# EAGLE design th (EAGLE 9.3.0)
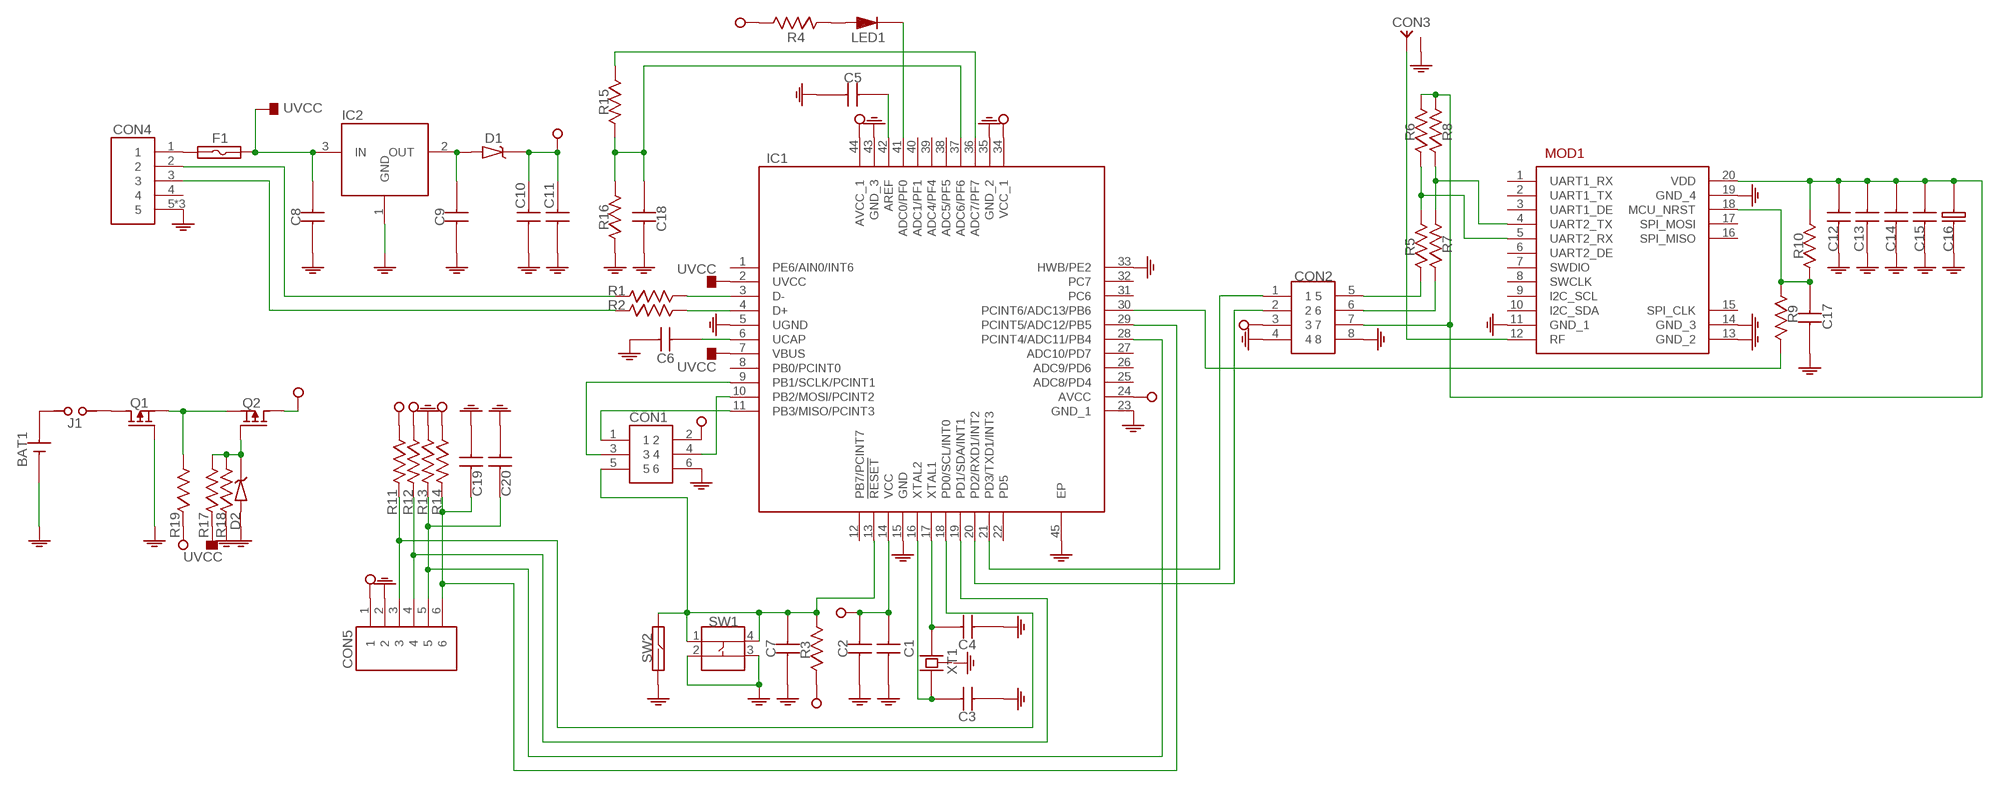
[diagram p0: schematic, sheet 1]

## Parts
BAT1  211P-C-HOLDER  [211P-C-HOLDER]
C1  CAPACITOR-0603  [0603]
C2  CAPACITOR-0603  [0603]
C3  CAPACITOR-0603  [0603]
C4  CAPACITOR-0603  [0603]
C5  CAPACITOR-0603  [0603]
C6  CAPACITOR-0603  [0603]
C7  CAPACITOR-0603  [0603]
C8  CAPACITOR-0805  [0805]
C9  CAPACITOR-0805  [0805]
C10  CAPACITOR-0603  [0603]
C11  CAPACITOR-0603  [0603]
C12  CAPACITOR-0603  [0603]
C13  CAPACITOR-0603  [0603]
C14  CAPACITOR-0603  [0603]
C15  CAPACITOR-0603  [0603]
C16  CAPACITOR-10-5  [CAPACITOR-10-5]
C17  CAPACITOR-0603  [0603]
C18  CAPACITOR-0603  [0603]
C19  CAPACITOR-0603  [0603]
C20  CAPACITOR-0603  [0603]
CON1  ISP  [ISP]
CON2  HEADER-8P-2R-DIP-2_54MM  [HEADER-8P-2R-DIP-2_54MM]
CON3  SMA-RF  [SMA-RF]
CON4  USB-MICRO-DIP-VER  [USB-MICRO-DIP-VER]
CON5  HEADER-6P-DIP-2_54MM  [HEADER-6P-DIP-2_54MM]
D1  DIODE-SCHOTTKY  [SOD123-DIODE]
D2  ZENER-SOD123  [SOD123-DIODE]
F1  FUSE-1206  [1206]
IC1  ATMEGA32U4-MU  [QFN-44]
IC2  VREG-SOT23-3  [SOT23-3]
J1  JUMPER  [HEADER-2P-DIP-2_54MM]
LED1  LED-0805  [0805-LED]
MOD1  RAK4200  [RAK4200]
Q1  P-MOSFET  [SOT23-3]
Q2  P-MOSFET  [SOT23-3]
R1  RESISTOR-0603  [0603]
R2  RESISTOR-0603  [0603]
R3  RESISTOR-0603  [0603]
R4  RESISTOR-0603  [0603]
R5  RESISTOR-0603  [0603]
R6  RESISTOR-0603  [0603]
R7  RESISTOR-0603  [0603]
R8  RESISTOR-0603  [0603]
R9  RESISTOR-0603  [0603]
R10  RESISTOR-0603  [0603]
R11  RESISTOR-0603  [0603]
R12  RESISTOR-0603  [0603]
R13  RESISTOR-0603  [0603]
R14  RESISTOR-0603  [0603]
R15  RESISTOR-0603  [0603]
R16  RESISTOR-0603  [0603]
R17  RESISTOR-0603  [0603]
R18  RESISTOR-0603  [0603]
R19  RESISTOR-0603  [0603]
SW1  BUTTON-4P-SMD-5X5  [BUTTON-4P-SMD-5X5]
SW2  REED-DIP  [REED-DIP]
XT1  CRYSTAL-5032-4P  [CRYSTAL-5032-4P]

## Nets
GND: BAT1.2(-) C1.1 C2.1 C3.1 C4.1 C5.1 C6.1 C7.1 C8.1 C9.1 C10.1 C11.1 C12.1 C13.1 C14.1 C15.1 C16.P$1 C17.1 C18.1 C19.1 C20.1 CON1.6 CON2.4 CON2.8 CON3.2(GND) CON3.3(GND) CON3.4(GND) CON3.5(GND) CON4.5 CON4.6 CON4.7 CON5.2 D2.2(A) IC1.5(UGND) IC1.15(GND) IC1.23(GND_1) IC1.33(HWB/PE2) IC1.35(GND_2) IC1.43(GND_3) IC1.45(EP) IC2.1(GND) MOD1.11(GND_1) MOD1.13(GND_2) MOD1.14(GND_3) MOD1.19(GND_4) Q1.1(G) R13.1 R16.1 R18.1 SW1.2 SW1.3 SW2.P$2
N$1: C7.2 CON1.5 IC1.13(!RESET) R3.2 SW1.1 SW1.4 SW2.P$1
N$2: C17.2 MOD1.18(MCU_NRST) R9.1 R10.1
N$3: CON1.1 IC1.11(PB3/MISO/PCINT3)
N$4: CON3.1(ANT) MOD1.12(RF)
N$5: J1.1 Q1.3(D)
N$6: CON2.5 R5.1
N$7: CON2.6 R7.1
N$8: BAT1.1(+) J1.2
N$9: CON1.4 IC1.10(PB2/MOSI/PCINT2)
N$10: C3.2 IC1.16(XTAL2) XT1.1
N$11: CON2.2 IC1.20(PD2/RXD1/INT2)
N$12: C4.2 IC1.17(XTAL1) XT1.3
N$13: IC1.41(ADC0/PF0) LED1.1(K)
N$14: C20.2 CON5.5 IC1.28(PCINT4/ADC11/PB4) R13.2
N$15: C9.2 D1.2(A) IC2.2(OUT)
N$16: IC1.30(PCINT6/ADC13/PB6) R9.2
N$17: CON4.2 R1.1
N$18: IC1.3(D-) R1.2
N$19: IC1.4(D+) R2.2
N$20: C18.2 IC1.37(ADC6/PF6) R15.2 R16.2
N$21: D2.1(K) Q2.1(G) R17.2 R18.2
N$22: C12.2 C13.2 C14.2 C15.2 C16.P$2 CON2.7 MOD1.20(VDD) R6.2 R8.2 R10.2
N$23: CON2.1 IC1.21(PD3/TXD1/INT3)
N$24: CON4.3 R2.1
N$25: C19.2 CON5.6 IC1.29(PCINT5/ADC12/PB5) R14.2
N$26: Q1.2(S) Q2.2(S) R19.2
N$30: MOD1.4(UART2_TX) R7.2 R8.1
N$31: C5.2 IC1.42(AREF)
N$32: MOD1.5(UART2_RX) R5.2 R6.1
N$33: CON4.1 F1.1
N$34: C6.2 IC1.6(UCAP)
N$35: LED1.2(A) R4.1
N$36: IC1.36(ADC7/PF7) R15.1
N$45: CON1.3 IC1.9(PB1/SCLK/PCINT1)
N$73: CON5.3 IC1.18(PD0/SCL/INT0) R11.2
N$79: CON5.4 IC1.19(PD1/SDA/INT1) R12.2
UVCC: C8.2 F1.2 IC1.2(UVCC) IC1.7(VBUS) IC2.3(IN) R17.1
VCC: C1.2 C2.2 C10.2 C11.2 CON1.2 CON2.3 CON5.1 D1.1(K) IC1.14(VCC) IC1.24(AVCC) IC1.34(VCC_1) IC1.44(AVCC_1) Q2.3(D) R3.1 R4.2 R11.1 R12.1 R14.1 R19.1
Unconnected: CON4.4 IC1.1(PE6/AIN0/INT6) IC1.8(PB0/PCINT0) IC1.12(PB7/PCINT7) IC1.22(PD5) IC1.25(ADC8/PD4) IC1.26(ADC9/PD6) IC1.27(ADC10/PD7) IC1.31(PC6) IC1.32(PC7) IC1.38(ADC5/PF5) IC1.39(ADC4/PF4) IC1.40(ADC1/PF1) MOD1.1(UART1_RX) MOD1.2(UART1_TX) MOD1.3(UART1_DE) MOD1.6(UART2_DE) MOD1.7(SWDIO) MOD1.8(SWCLK) MOD1.9(I2C_SCL) MOD1.10(I2C_SDA) MOD1.15(SPI_CLK) MOD1.16(SPI_MISO) MOD1.17(SPI_MOSI)

## Power pins joined to a net without a drawn wire
GND: XT1.2(GND) XT1.4(GND)

## Library data of the parts
BAT1 = myparts:211P-C-HOLDER
C1-C7 C10-C15 C17-C20 = myparts:CAPACITOR-0603
C8 C9 = myparts:CAPACITOR-0805
C16 = myparts:CAPACITOR-10-5
CON1 = myparts:ISP
CON2 = myparts:HEADER-8P-2R-DIP-2_54MM
CON3 = myparts:SMA-RF
CON4 = myparts:USB-MICRO-DIP-VER
CON5 = myparts:HEADER-6P-DIP-2_54MM
D1 = myparts:DIODE-SCHOTTKY
D2 = myparts:ZENER-SOD123
F1 = myparts:FUSE-1206
IC1 = myparts:ATMEGA32U4-MU
IC2 = myparts:VREG-SOT23-3
J1 = myparts:JUMPER
LED1 = myparts:LED-0805
MOD1 = myparts:RAK4200
Q1 Q2 = myparts:P-MOSFET
R1-R19 = myparts:RESISTOR-0603
SW1 = myparts:BUTTON-4P-SMD-5X5
SW2 = myparts:REED-DIP
XT1 = myparts:CRYSTAL-5032-4P

## Board
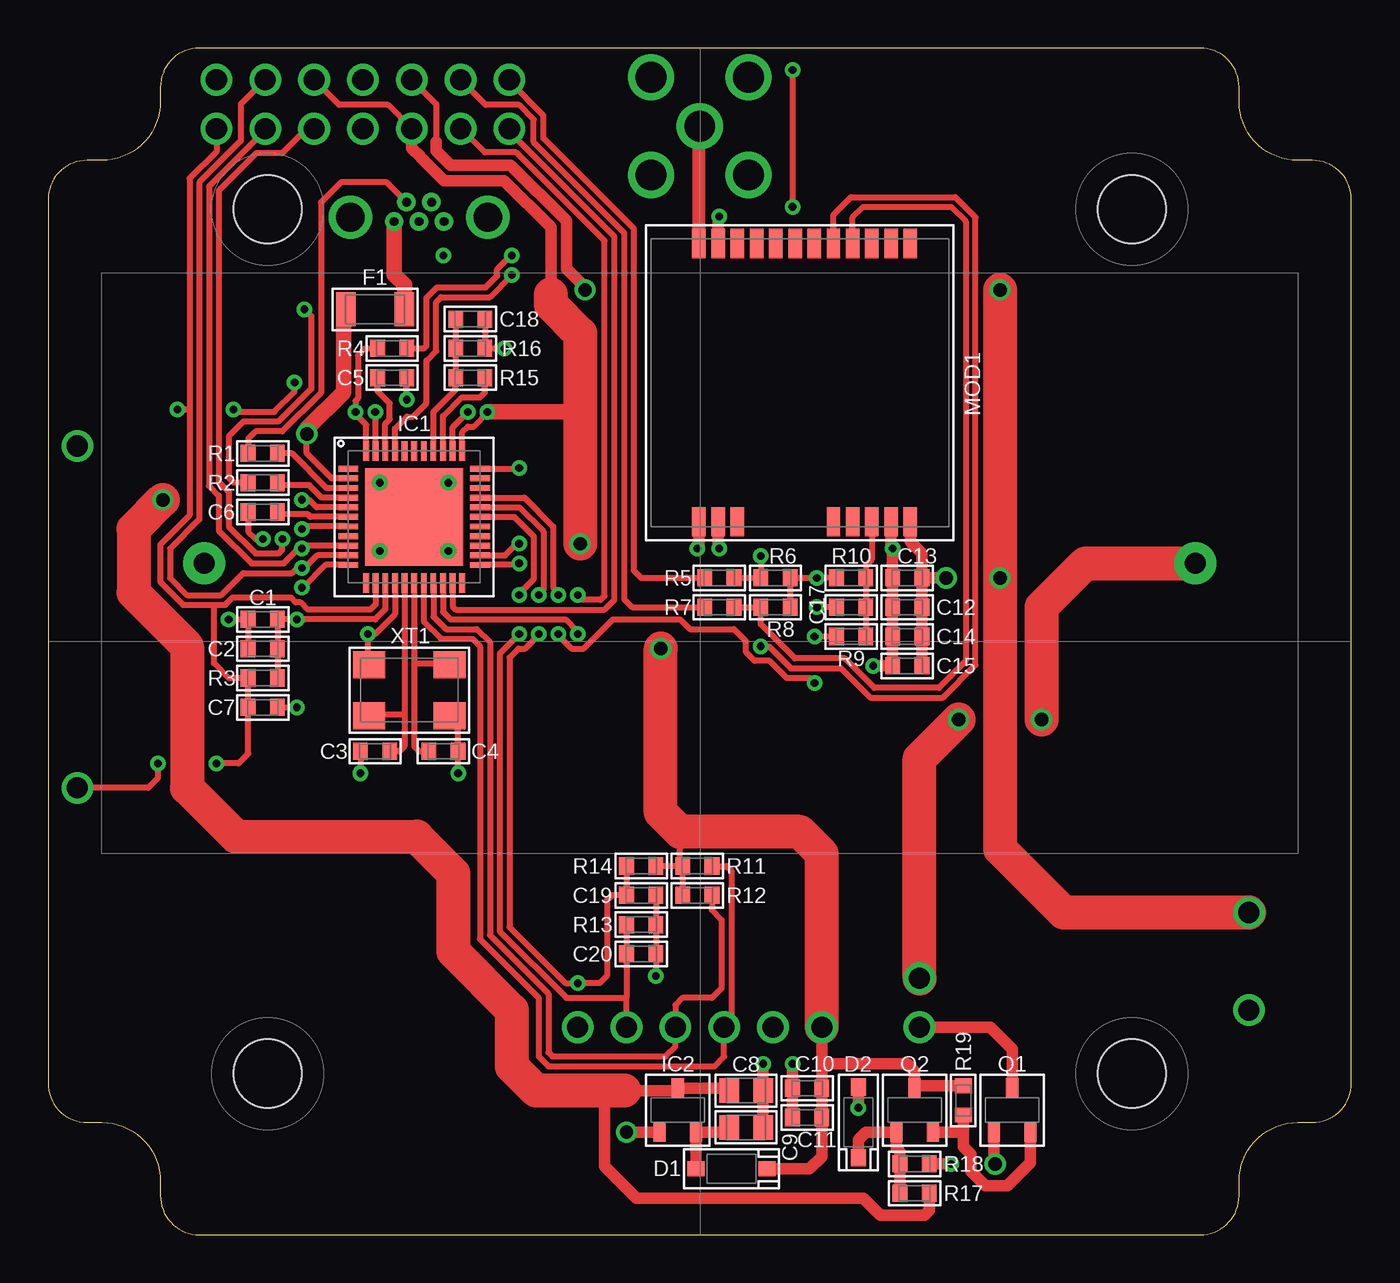
[diagram p1: board, top side]
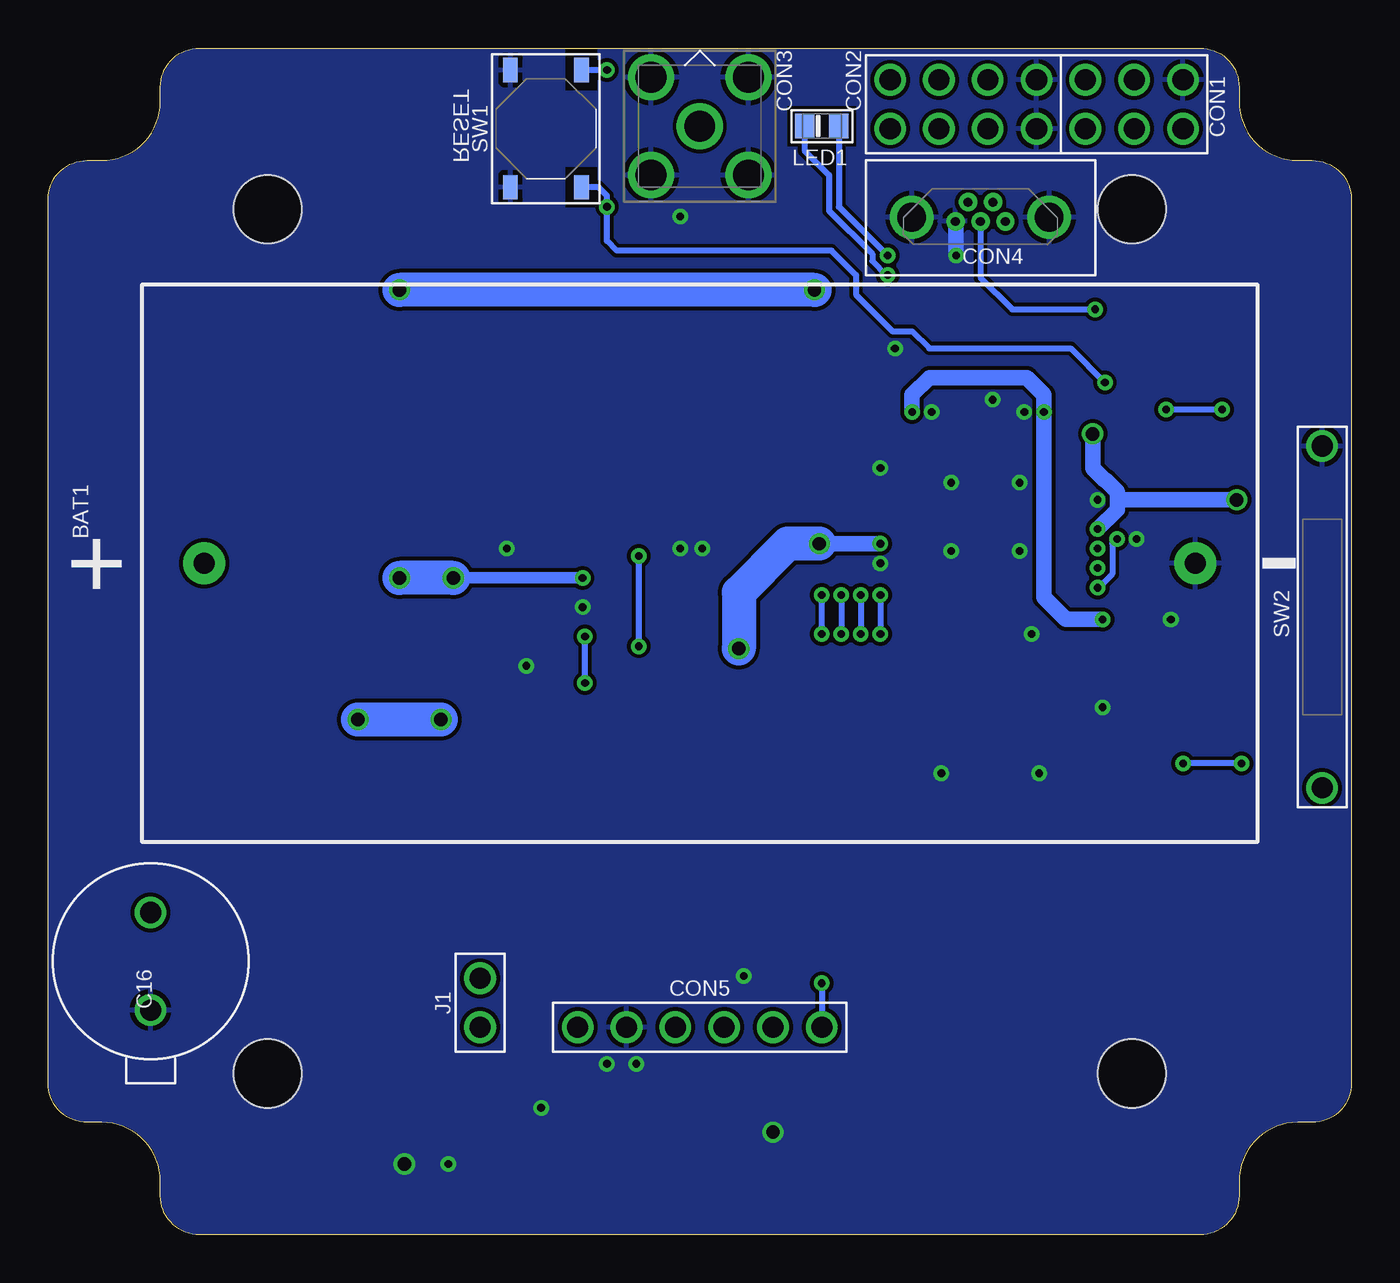
[diagram p2: board, bottom side, seen from below]

Size 67.82 x 61.72 mm. Coordinates in mm from the lower left corner, seen from the top.
Outline: 0,53.85 0,7.87 arc90 2.03,5.84 2.79,5.84 arc-90 5.84,2.79 5.84,2.03 arc90 7.87,0 59.94,0 arc90 61.98,2.03 61.98,2.79 arc-90 65.02,5.84 65.79,5.84 arc90 67.82,7.87 67.82,53.85 arc90 65.79,55.88 65.02,55.88 arc-90 61.98,58.93 61.98,59.69 arc90 59.94,61.72 7.87,61.72 arc90 5.84,59.69 5.84,58.93 arc-90 2.79,55.88 2.03,55.88 arc90 0,53.85
Copper layers (1*16): Top 0.035mm / dielectric 1.5mm / Bottom 0.035mm
Design rules "myparts *": minimum track width 12mil, minimum drill 0.4mm, track to track 8mil, track to pad 10mil, pad to pad 10mil, via to via 8mil, smd to smd 0mil, copper to edge 0mil, drill to drill 6mil, minimum pad ring 10mil, minimum via ring 8mil, stop-mask expansion 4mil, vias tented up to drill 25mil, thermal gap 10mil
Holes 3.56 mm at 11.43,53.34 56.39,53.34 56.39,8.38 11.43,8.38

### Footprints (pad centres in the part's own frame; a part is rotated, then mirrored left to right if it is on the bottom)
211P-C-HOLDER = drill 1.1 pad 2.184: 1 -25.781,0; 2 25.781,0
0603 = smd 0.762 x 0.889: 1 -0.762,0; 2 0.762,0
0805 = smd 1.016 x 1.27: 1 -0.889,0; 2 0.889,0
CAPACITOR-10-5 = drill 1.1: P$1 -2.54,0; P$2 2.54,0
ISP = drill 1.1 pad 1.65: 1 0,0; 2 2.54,0; 3 0,-2.54; 4 2.54,-2.54; 5 0,-5.08; 6 2.54,-5.08
HEADER-8P-2R-DIP-2_54MM = drill 1.1 pad 1.65: 1 0,0; 2 2.54,0; 3 5.08,0; 4 7.62,0; 5 0,2.54; 6 2.54,2.54; 7 5.08,2.54; 8 7.62,2.54
SMA-RF = drill 1.6: 1 0,0; 2 -2.54,2.54; 3 -2.54,-2.54; 4 2.54,-2.54; 5 2.54,2.54
USB-MICRO-DIP-VER = drill 0.45: 1 -1.3,0; 2 -0.65,-1; 3 0,0; 4 0.65,-1; 5 1.3,0 | drill 1.5: 6 -3.575,-0.22; 7 3.575,-0.22
HEADER-6P-DIP-2_54MM = drill 1.1 pad 1.65: 1 0,0; 2 2.54,0; 3 5.08,0; 4 7.62,0; 5 10.16,0; 6 12.7,0
SOD123-DIODE = smd 0.889 x 0.762: 1 -1.841,0; 2 1.841,0
1206 = smd 1.016 x 1.778: 1 -1.524,0; 2 1.524,0
QFN-44 = smd 1.016 x 0.305: 1 -3.429,2.5; 2 -3.429,2; 3 -3.429,1.5; 4 -3.429,1; 5 -3.429,0.5; 6 -3.429,0; 7 -3.429,-0.5; 8 -3.429,-1; 9 -3.429,-1.5; 10 -3.429,-2; 11 -3.429,-2.5; 23 3.429,-2.5; 24 3.429,-2; 25 3.429,-1.5; 26 3.429,-1; 27 3.429,-0.5; 28 3.429,0; 29 3.429,0.5; 30 3.429,1; 31 3.429,1.5; 32 3.429,2; 33 3.429,2.5 | smd 0.305 x 1.016: 12 -2.5,-3.429; 13 -2,-3.429; 14 -1.5,-3.429; 15 -1,-3.429; 16 -0.5,-3.429; 17 0,-3.429; 18 0.5,-3.429; 19 1,-3.429; 20 1.5,-3.429; 21 2,-3.429; 22 2.5,-3.429; 34 2.5,3.429; 35 2,3.429; 36 1.5,3.429; 37 1,3.429; 38 0.5,3.429; 39 0,3.429; 40 -0.5,3.429; 41 -1,3.429; 42 -1.5,3.429; 43 -2,3.429; 44 -2.5,3.429 | smd 5.08 x 5.08: 45 0,0
SOT23-3 = smd 1.016 x 0.635: 1 -1.143,0.95; 2 -1.143,-0.95; 3 1.143,0
HEADER-2P-DIP-2_54MM = drill 1.1 pad 1.65: 1 0,-1.27; 2 0,1.27
0805-LED = smd 1.016 x 1.27: 1 -0.889,0; 2 0.889,0
RAK4200 = smd 1.524 x 0.7: 1 -7.239,5.75; 2 -7.239,4.75; 3 -7.239,3.75; 4 -7.239,2.75; 5 -7.239,1.75; 6 -7.239,0.75; 7 -7.239,-0.25; 8 -7.239,-1.25; 9 -7.239,-2.25; 10 -7.239,-3.25; 11 -7.239,-4.25; 12 -7.239,-5.25; 13 7.239,-5.25; 14 7.239,-4.25; 15 7.239,-3.25; 16 7.239,1.75; 17 7.239,2.75; 18 7.239,3.75; 19 7.239,4.75; 20 7.239,5.75
BUTTON-4P-SMD-5X5 = smd 1.27 x 0.762: 1 -3.048,1.85; 2 -3.048,-1.85; 3 3.048,-1.85; 4 3.048,1.85
REED-DIP = drill 1.1: P$1 -8.89,0; P$2 8.89,0
CRYSTAL-5032-4P = smd 1.651 x 1.397: 1 -2.095,-1.333; 2 2.095,-1.333; 3 2.095,1.333; 4 -2.095,1.333

### Placement (x,y rotation side)
BAT1  33.91,34.92 0 bottom
C1  11.18,32 0 top
C2  11.18,30.48 0 top
C3  17.02,25.15 0 top
C4  20.57,25.15 180 top
C5  17.91,44.58 180 top
C6  11.18,37.59 0 top
C7  11.18,27.43 180 top
C8  36.32,7.49 180 top
C9  36.32,5.59 180 top
C10  39.5,7.62 0 top
C11  39.5,6.1 0 top
C12  44.7,32.64 0 top
C13  44.7,34.16 0 top
C14  44.7,31.11 0 top
C15  44.7,29.59 0 top
C16  62.48,14.22 90 bottom
C17  41.78,32.64 0 top
C18  21.97,47.62 180 top
C19  30.86,17.65 180 top
C20  30.86,14.61 180 top
CON1  13.84,57.53 90 bottom
CON2  24,57.53 0 bottom
CON3  33.91,57.66 0 bottom
CON4  19.3,52.7 180 bottom
CON5  40.26,10.79 0 bottom
D1  35.56,3.43 180 top
D2  42.16,5.84 90 top
F1  17.02,48.13 180 top
IC1  19.05,37.34 0 top
IC2  32.77,6.48 90 top
J1  45.34,12.06 0 bottom
LED1  27.56,57.66 0 bottom
MOD1  39.12,44.32 270 top
Q1  50.16,6.48 90 top
Q2  45.09,6.48 90 top
R1  11.18,40.64 0 top
R2  11.18,39.12 0 top
R3  11.18,28.96 180 top
R4  17.91,46.1 180 top
R5  34.92,34.16 0 top
R6  37.85,34.16 0 top
R7  34.92,32.64 0 top
R8  37.85,32.64 0 top
R9  41.78,31.11 180 top
R10  41.78,34.16 180 top
R11  33.78,19.18 0 top
R12  33.78,17.65 0 top
R13  30.86,16.13 180 top
R14  30.86,19.18 180 top
R15  21.97,44.58 180 top
R16  21.97,46.1 180 top
R17  45.09,2.16 180 top
R18  45.09,3.68 180 top
R19  47.62,6.99 270 top
SW1  41.91,57.53 270 bottom
SW2  1.52,32.13 90 bottom
XT1  18.8,28.32 0 top

### Tracks (layer width: path | path; a pad name or v marks a point on that pad's centre or on a via)
GND  (via drill 0.4, 0.7)
  Top 0.305: IC1.43 17.05,42.77 v17.02,42.8 | v18.67,43.43 C5.1 | v24.51,34.92 24.42,34.84 IC1.23 | C2.1 C1.1 v9.4,32 | C7.1 v12.95,27.43 | C3.1 v16.26,24 | v21.34,24 C4.1 21.34,26.54 XT1.2 | XT1.4 16.64,29.72 v16.64,31.24 17.02,31.24 18.05,32.27 IC1.15 | C6.1 10.41,36.58 10.79,36.2 v11.18,36.2 | C19.1 R13.1 C20.1 v31.62,13.46 | C17.1 v40.01,32.64 | C18.1 R16.1 v23.75,46.1 | IC1.35 21.05,42.01 v21.84,42.8 | IC1.33 24.47,39.84 v24.51,39.88 | IC1.5 13.98,37.84 13.59,38.23 v13.21,38.23 | IC1.45 v20.83,35.56
  Top 0.381: 49.22,3.74 v49.28,3.68
  Top 0.61: Q1.1 49.22,3.74 | MOD1.19 43.87,35.76 v43.94,35.69 C13.1 C12.1 C14.1 C15.1 v42.93,29.59 | v34.92,52.96 34.87,52.9 MOD1.11 | MOD1.14 34.87,35.75 v34.92,35.69 | MOD1.13 33.87,35.77 v33.78,35.69 | C9.1 C8.1 v37.21,8.89 | IC2.1 v30.1,5.33 | C11.1 C10.1 v38.73,8.89 | D2.2 v42.16,6.6 | R18.1 v46.99,3.68
  Bottom 0.305: 20.57,52.7 CON4.5
  Bottom 0.813: v20.57,50.93 20.57,52.7
  other vias: 17.27,39.12 20.83,39.12 17.27,35.56
  pour Bottom: 5.97,2.16 5.97,2.92 arc90 2.92,5.97 2.16,5.97 arc-90 0.13,8 0.13,53.72 arc-90 2.16,55.75 2.92,55.75 arc90 5.97,58.8 5.97,59.56 arc-90 8,61.59 59.82,61.59 arc-90 61.85,59.56 61.85,58.8 arc90 64.9,55.75 65.66,55.75 arc-90 67.69,53.72 67.69,8 arc-90 65.66,5.97 64.9,5.97 arc90 61.85,2.92 61.85,2.16 arc-90 59.82,0.13 8,0.13 arc-90
  cutout Bottom: 39.24,59.56 39.24,61.59 40.89,61.59 40.89,59.56
GND1
  cutout Bottom: 39.24,53.47 39.24,55.5 40.89,55.5 40.89,53.47
GND2
  cutout Bottom: 25.78,56.64 25.78,58.67 29.34,58.67 29.34,56.64
N$1  (via drill 0.4)
  Top 0.305: CON1.5 8.76,56.34 7.37,54.94 7.37,42.93 | IC1.13 17.05,32.8 16.76,32.51 13.52,32.51 13.13,32.9 12.89,32.9 12.64,33.15 9.61,33.15 9.23,32.77 8.64,32.77 | v38.73,60.58 v38.73,53.47 | v6.73,42.93 7.37,42.93 | v9.65,42.93 9.78,42.8 11.77,42.8 12.83,43.85 v12.83,44.32 | v8.76,24.51 9.91,24.51 10.41,25.02 C7.2 R3.2 9.4,28.96 8.64,29.72 8.64,32.77 | 7.37,42.93 7.37,37.42 5.84,35.9 5.84,33.95 7.03,32.77 8.64,32.77 | v5.71,24.51 5.71,23.75 5.21,23.24 SW2.P$1
  Bottom 0.305: v38.73,60.58 SW1.1 | SW1.4 39.17,54.48 38.73,54.05 v38.73,53.47 38.73,51.69 38.23,51.18 27.05,51.18 25.78,49.91 25.78,48.9 23.88,46.99 22.86,46.99 21.97,46.1 14.61,46.1 v12.83,44.32 | v9.65,42.93 v6.73,42.93 | v5.71,24.51 v8.76,24.51
N$2
  Top 0.305: MOD1.18 42.87,35.12 42.55,34.8 R10.1 C17.2 R9.1
N$3  (via drill 0.4)
  Top 0.305: CON1.1 13.46,57.53 12.19,56.26 10.84,56.26 8.89,54.31 8.89,39.16 9.4,38.65 9.4,36.83 10.79,35.43 11.99,35.43 12.19,35.63 v12.19,36.2 | IC1.11 14.45,34.84 13.27,33.66 v13.21,33.66
  Bottom 0.305: v12.19,36.2 12.45,35.94 12.45,34.36 13.15,33.66 v13.21,33.66
N$4
  Top 0.686: MOD1.12 33.87,57.62 CON3.1
N$5
  Top 0.61: Q1.3 50.16,9.65 49.02,10.79 J1.1
N$6
  Top 0.305: R5.1 30.86,34.16 30.48,34.54 30.48,52.32 25.78,57.02 25.78,58.21 24,59.99 CON2.5
N$7
  Top 0.305: CON2.6 22.77,58.76 24.51,58.76 25.27,58 25.27,56.81 29.97,52.11 29.97,33.06 30.4,32.64 R7.1
N$8  (via drill 0.7)
  Top 1.778: J1.2 45.34,24.77 v47.37,26.8 | v51.69,26.8 51.69,32.64 53.98,34.92 BAT1.1
  Bottom 1.778: v47.37,26.8 v51.69,26.8
N$9  (via drill 0.4)
  Top 0.305: CON1.4 10.03,58.8 10.03,56.89 7.87,54.73 7.87,37.21 6.35,35.69 6.35,34.16 7.24,33.27 9.02,33.27 10.16,34.42 12.7,34.42 12.95,34.67 v13.21,34.67 13.34,34.67 14,35.34 IC1.10
N$10
  Top 0.305: IC1.16 18.55,27.05 | 18.55,27.05 18.55,25.41 18.29,25.15 C3.2 | 18.55,27.05 16.76,27.05 XT1.1
N$11  (via drill 0.4)
  Top 0.305: IC1.20 20.55,32.41 20.95,32 26.92,32 27.56,31.37 v27.56,31.24 | v27.56,33.27 27.81,33.02 28.75,33.02 28.96,33.23 28.96,51.69 24.35,56.3 22.73,56.3 21.5,57.53 CON2.2
  Bottom 0.305: v27.56,31.24 v27.56,33.27
N$12
  Top 0.305: IC1.17 19.05,29.72 | 19.05,29.72 19.05,25.4 19.3,25.15 C4.2 | 19.05,29.72 20.83,29.72 XT1.3
N$13  (via drill 0.4)
  Top 0.305: IC1.41 18.05,41.93 18.67,42.55 18.98,42.55 19.68,43.25 19.68,45.47 20.19,45.97 20.19,48.51 20.45,48.77 22.99,48.77 v24.13,49.91
  Bottom 0.305: LED1.1 28.45,56.39 27.18,55.12 27.18,53.26 24.93,51.01 24.93,50.66 24.19,49.91 v24.13,49.91
N$14  (via drill 0.4)
  Top 0.305: R13.2 C20.2 30.1,12.32 | v24.51,31.24 23.5,30.23 23.5,15.79 26.97,12.32 30.1,12.32 | v24.51,33.27 24.51,33.34 25.27,34.1 25.27,36.33 24.26,37.34 IC1.28 | CON5.5 30.1,12.32
  Bottom 0.305: v24.51,33.27 v24.51,31.24
N$15
  Top 0.61: C9.2 35.18,5.33 IC2.2 D1.2
N$16  (via drill 0.4)
  Top 0.305: R9.2 v39.88,31.11 | v39.88,28.7 39.62,28.96 38.44,28.96 37.55,29.85 36.77,29.85 36.33,30.29 36.33,30.86 35.69,31.5 33.4,31.5 32.89,32 29.39,32 27.87,30.48 27.25,30.48 26.54,31.18 v26.54,31.24 | IC1.30 24.78,38.34 26.29,36.83 26.29,33.66 26.54,33.4 v26.54,33.27
  Bottom 0.305: v39.88,28.7 v39.88,31.11 | v26.54,33.27 v26.54,31.24
N$17
  Top 0.305: CON4.2 17.62,54.74 15.24,54.74 14.2,53.7 14.2,43.79 12.19,41.78 10.79,41.78 10.41,41.4 R1.1
N$18
  Top 0.305: IC1.3 14.5,38.84 12.7,40.64 R1.2
N$19
  Top 0.305: IC1.4 14.24,38.34 13.59,38.99 12.06,38.99 R2.2
N$20
  Top 0.305: C18.2 R16.2 R15.2 21.21,43.96 20.05,42.8 IC1.37
N$21
  Top 0.61: D2.1 42.16,4.95 42.55,5.33 Q2.1 44.13,4.51 44.32,4.32 R18.2 R17.2
N$22  (via drill 0.4, 0.7)
  Top 0.305: R10.2 v40.01,34.16 R6.2 R8.2 | CON2.7 20.19,58.8 20.19,56.84
  Top 0.61: MOD1.20 44.87,36.03 45.47,35.43 C13.2 | C13.2 C12.2 C14.2 C15.2 | C13.2 v46.74,34.16 | v27.94,49.15 27.94,49.28 26.98,50.24 26.98,52.74 24.08,55.64 20.94,55.64 20.19,56.39 20.19,56.84
  Top 1.778: v49.53,49.15 v49.53,34.16 49.53,20.07 52.83,16.76 C16.P$2
  Bottom 0.61: v46.74,34.16 v40.01,34.16
  Bottom 1.778: v27.94,49.15 v49.53,49.15 | v46.74,34.16 v49.53,34.16
N$23
  Top 0.305: IC1.21 21.05,32.67 21.21,32.51 28.96,32.51 29.46,33.02 29.46,51.9 24,57.36 CON2.1
N$24  (via drill 0.4)
  Top 0.305: R2.1 9.65,39.12 9.4,39.37 9.4,41.53 10.16,42.29 11.98,42.29 13.69,44 13.69,47.78 v13.34,48.13
  Bottom 0.305: CON4.3 19.3,49.78 17.65,48.13 v13.34,48.13
N$25  (via drill 0.4)
  Top 0.305: R14.2 C19.2 29.34,17.65 29.08,17.4 29.08,13.46 28.7,13.08 v27.56,13.08 26.92,13.08 24,16 24,30.02 24.47,30.48 24.82,30.48 25.53,31.18 v25.53,31.24 | IC1.29 24.52,37.84 25.78,36.58 25.78,33.52 v25.53,33.27
  Bottom 0.305: v25.53,33.27 v25.53,31.24 | v27.56,13.08 CON5.6
N$26
  Top 0.61: R19.2 47.62,5.33 | 47.62,5.33 47.62,4.57 48.01,4.19 48.01,3.3 48.77,2.54 49.91,2.54 51.12,3.74 Q1.2 | Q2.2 47.62,5.33
N$30
  Top 0.305: R7.2 R8.1 37.08,31.75 38.86,29.97 41.47,29.97 43,28.45 46.35,28.45 47.75,29.84 47.75,52.7 46.99,53.47 42.42,53.47 41.87,52.91 MOD1.4
N$31
  Top 0.305: IC1.42 17.55,42.19 17.78,42.42 17.78,43.24 17.14,43.87 C5.2
N$32  (via drill 0.4)
  Top 0.305: R5.2 R6.1 v37.08,35.31 | MOD1.5 40.87,53.06 41.78,53.98 47.2,53.98 48.26,52.91 48.26,29.64 46.56,27.94 42.78,27.94 41.26,29.46 38.65,29.46 37.51,30.61 v37.08,30.61
  Bottom 0.305: v37.08,35.31 v37.08,30.61
N$33
  Top 0.813: CON4.1 18,49.94 18.54,49.4 F1.1
N$34
  Top 0.305: IC1.6 13.65,37.34 13.52,37.46 12.07,37.46 C6.2
N$35  (via drill 0.4)
  Top 0.305: R4.1 19.56,46.1 19.68,46.23 19.68,48.72 20.24,49.28 22.78,49.28 23.37,49.87 23.37,50.23 24.07,50.93 v24.13,50.93
  Bottom 0.305: LED1.2 26.67,53.47 v24.13,50.93
N$36
  Top 0.305: IC1.36 20.55,42.58 21.53,43.56 22.48,43.56 22.73,43.81 R15.1
N$45  (via drill 0.4)
  Top 0.305: IC1.9 13.36,35.84 v13.21,35.69 13.02,35.69 12.26,34.92 10.59,34.92 8.89,36.62 8.89,38.44 8.38,38.95 8.38,54.52 11.3,57.44 CON1.3
N$73
  Top 0.305: IC1.18 19.55,31.89 20.45,30.99 22.1,30.99 22.48,30.61 22.48,15.37 25.53,12.32 25.53,9.27 26.04,8.76 34.67,8.76 35.18,9.27 CON5.3 35.56,11.18 35.56,18.92 35.31,19.18 R11.2
N$79
  Top 0.305: IC1.19 20.05,32.15 20.7,31.5 22.31,31.5 22.99,30.82 22.99,15.58 26.04,12.53 26.04,9.48 26.25,9.27 32.13,9.27 32.64,9.78 CON5.4 32.64,11.94 33.02,12.32 34.54,12.32 35.05,12.83 35.05,16.38 34.54,16.89 R12.2
UVCC  (via drill 0.4, 0.7)
  Top 0.305: IC1.7 13.34,36.84 v13.21,36.7 | IC1.2 14.76,39.34 13.46,40.64 v13.46,41.66
  Top 0.61: C8.2 35.31,7.62 IC2.3 32.64,7.49 29.97,7.49 | R17.1 45.85,1.27 45.59,1.02 43.31,1.02 42.42,1.91 30.61,1.91 28.96,3.56 28.96,7.49
  Top 0.813: F1.2 15.37,48.01 15.37,43.81 13.46,41.91 v13.46,41.66
  Top 1.778: v5.97,38.23 4.45,36.7 4.45,33.4 7.24,30.61 7.24,23.24 9.78,20.7 19.18,20.7 21.08,18.8 21.08,14.73 24.13,11.68 24.13,8.76 25.4,7.49 28.96,7.49 29.97,7.49
  Bottom 0.813: v13.21,36.7 12.19,37.72 12.19,38.23 | v13.46,41.66 13.46,39.88 12.82,39.24 12.79,39.24 12.19,38.64 12.19,38.23 | v5.97,38.23 12.19,38.23
VCC  (via drill 0.4, 0.7)
  Top 0.305: IC1.24 23.78,35.34 24.38,35.94 v24.51,35.94 | R3.1 C2.2 C1.2 v12.95,32 17.02,32 17.55,32.54 IC1.14 | R11.1 R14.1 | R11.1 R12.1 | CON2.3 17.69,58.76 15.15,58.76 CON1.2 | R4.2 16.51,46.1 16.13,45.72 16.13,43.5 16,43.37 v16,42.8 16,42.67 16.55,42.12 IC1.44 | IC1.34 21.55,41.74 21.84,42.04 22.16,42.04 22.86,42.74 v22.86,42.8 | R11.1 32.89,19.3 32.89,20.95
  Top 0.61: 26.16,48.9 26.16,52.4 23.74,54.83 20.61,54.83 19.38,56.05 19.38,56.06 18.92,56.52 CON2.3 | 40.26,8.89 C10.2 C11.2 40.26,4.06 39.62,3.43 D1.1 | 40.26,8.89 CON5.1 | R19.1 45.21,7.75 Q2.3 45.09,8.51 44.7,8.89 40.26,8.89
  Top 0.813: v22.86,42.8 27.69,42.8
  Top 1.778: CON5.1 40.26,19.81 39.12,20.95 32.89,20.95 31.88,21.97 v31.88,30.48 | 26.16,48.9 26.16,48.39 27.69,46.86 27.69,42.8 v27.69,35.94
  Bottom 0.813: v24.51,35.94 v27.69,35.94 | v22.86,42.8 22.86,43.69 21.97,44.58 16.89,44.58 16,43.69 v16,42.8 16,33.15 14.86,32 v12.95,32
  Bottom 1.778: v27.69,35.94 29.34,35.94 31.88,33.4 v31.88,30.48

### Text on the board
bNames: RESET | + | -